# EasyEDA Pro project ProPrj_大功率电调_2026-08-17.epro, schematic 主控板V1.2

## Sheets
1 主控LKS: Assembly Variant: Basic; Board Name: Board1; Create Date: 2026-08-04; Page Name: P1; Project Name: 大功率电调; Schematic Name: Schematic1; Update Date: 2026-08-04; Company: 嘉立创EDA; Page Size: A4; Version: V1.0
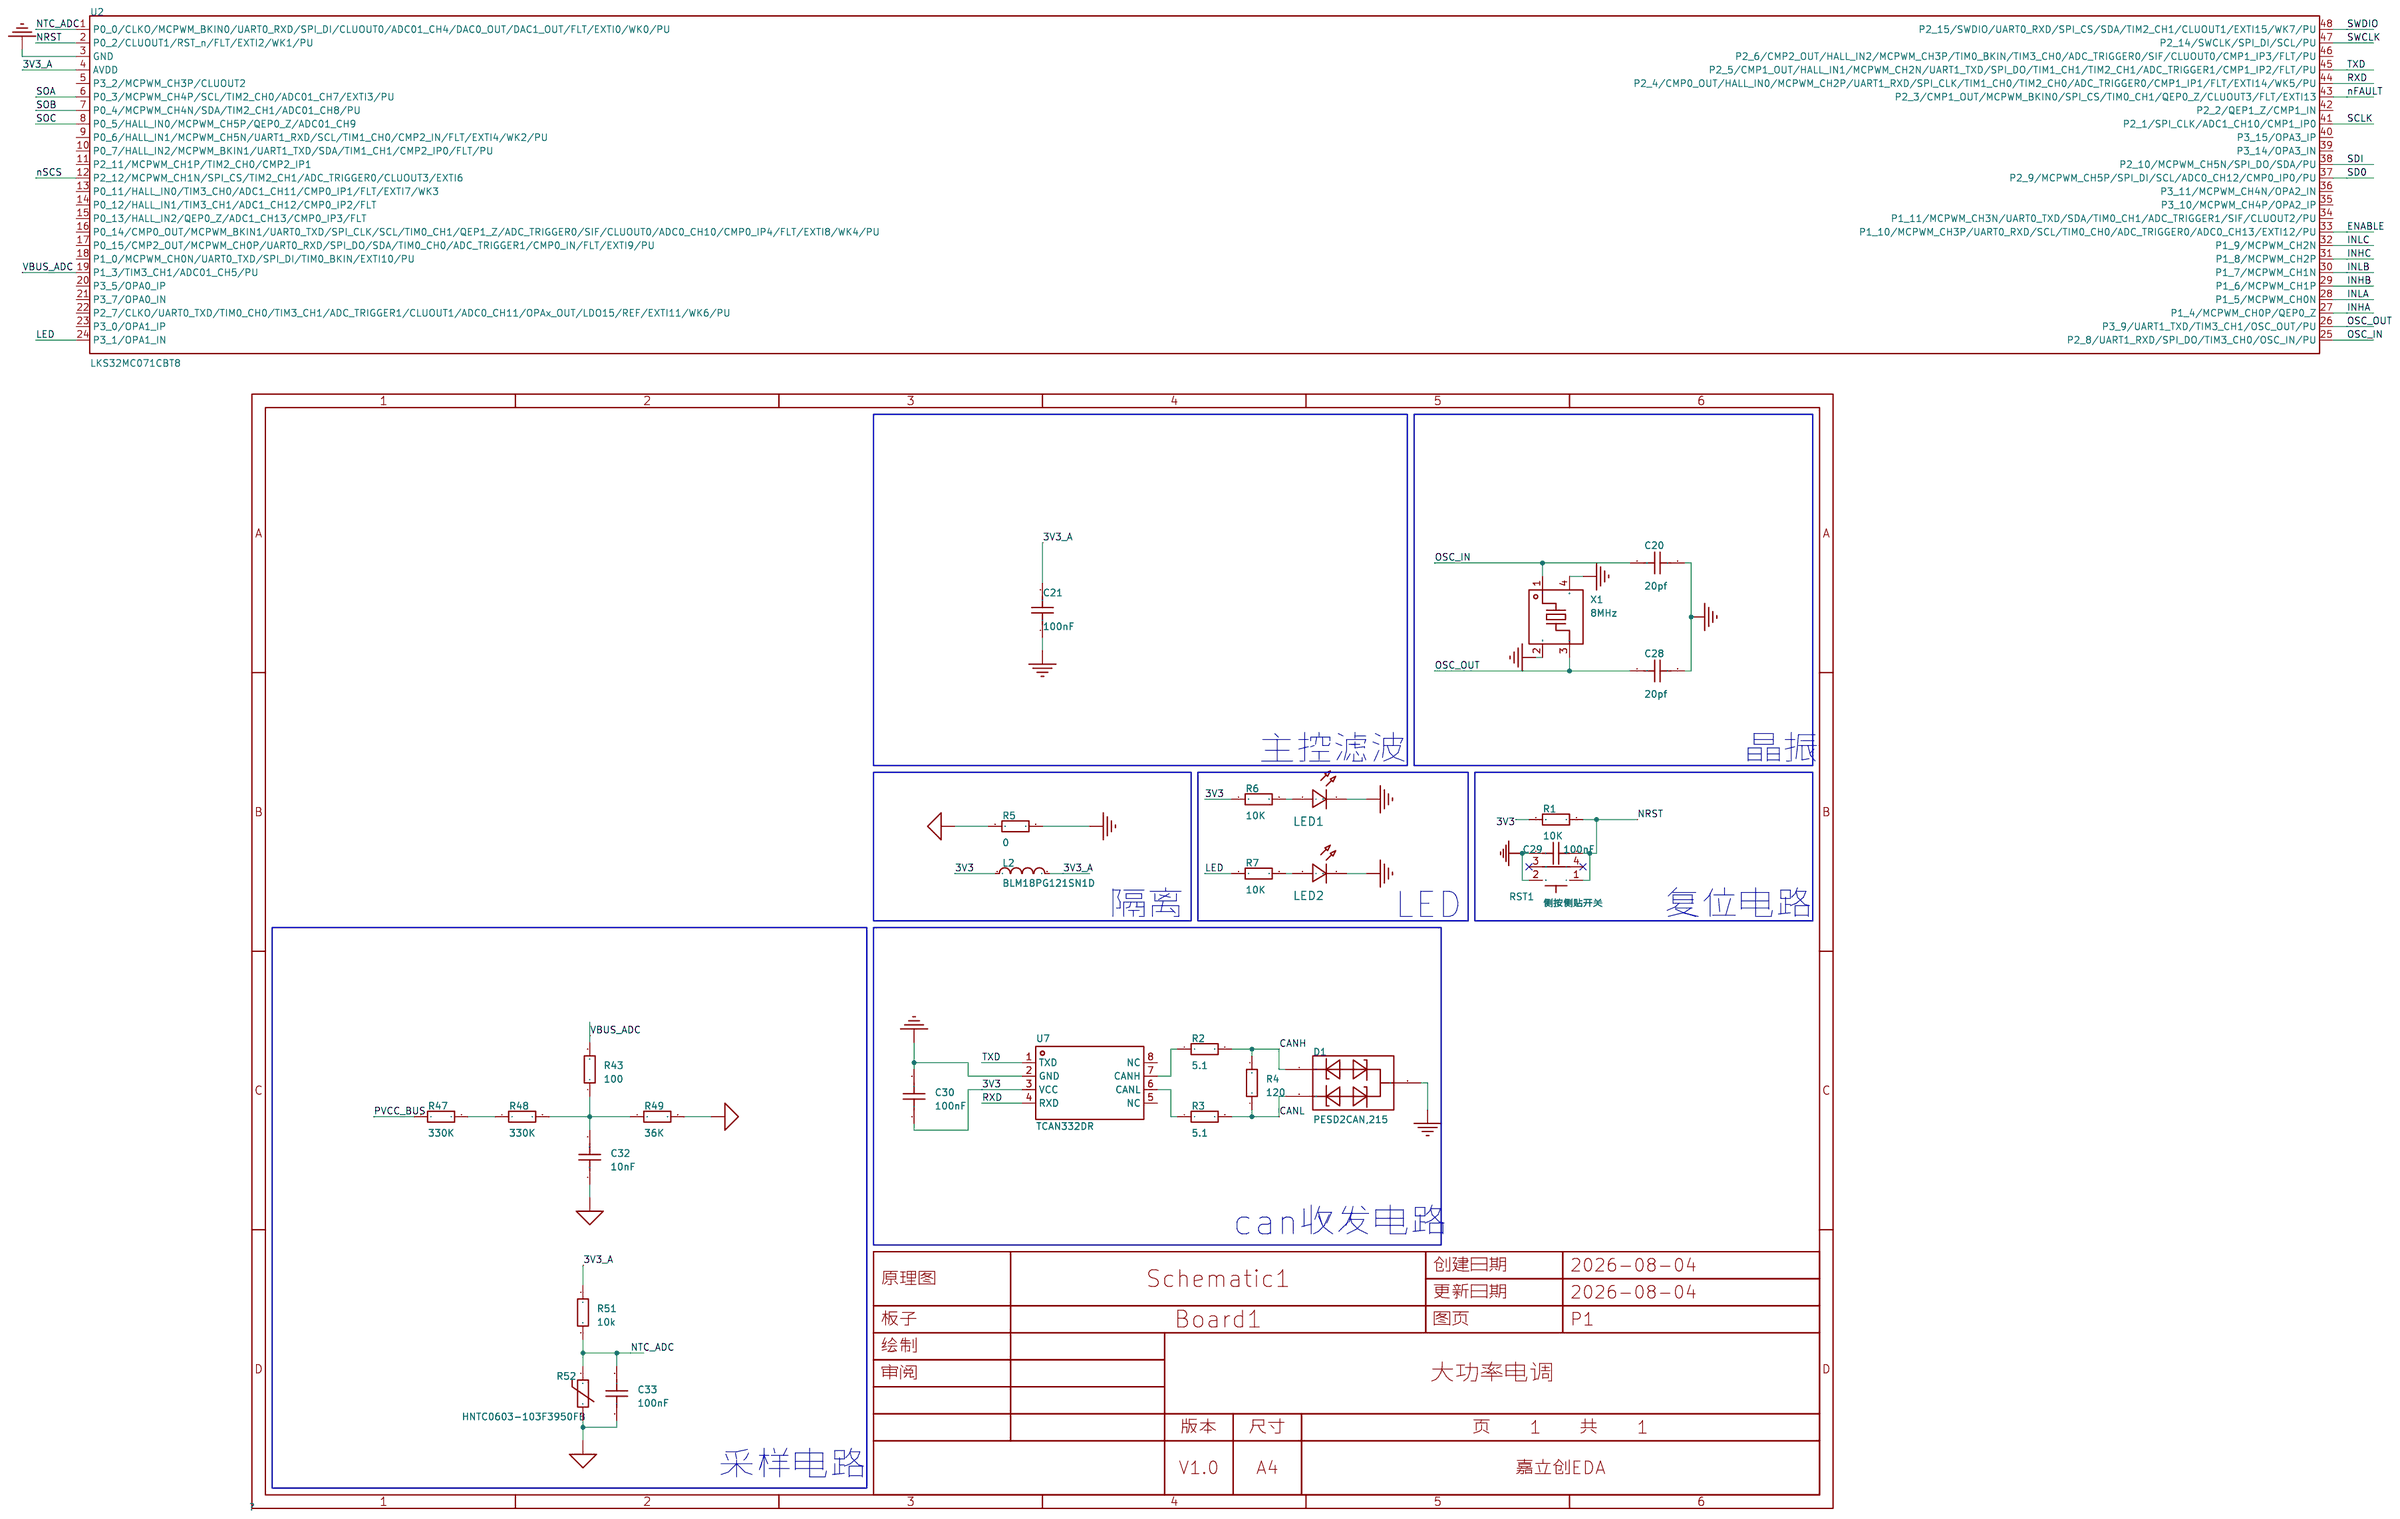
[diagram p14: 主控LKS]
2 驱动: Board Name: 主控板; Page Name: P2
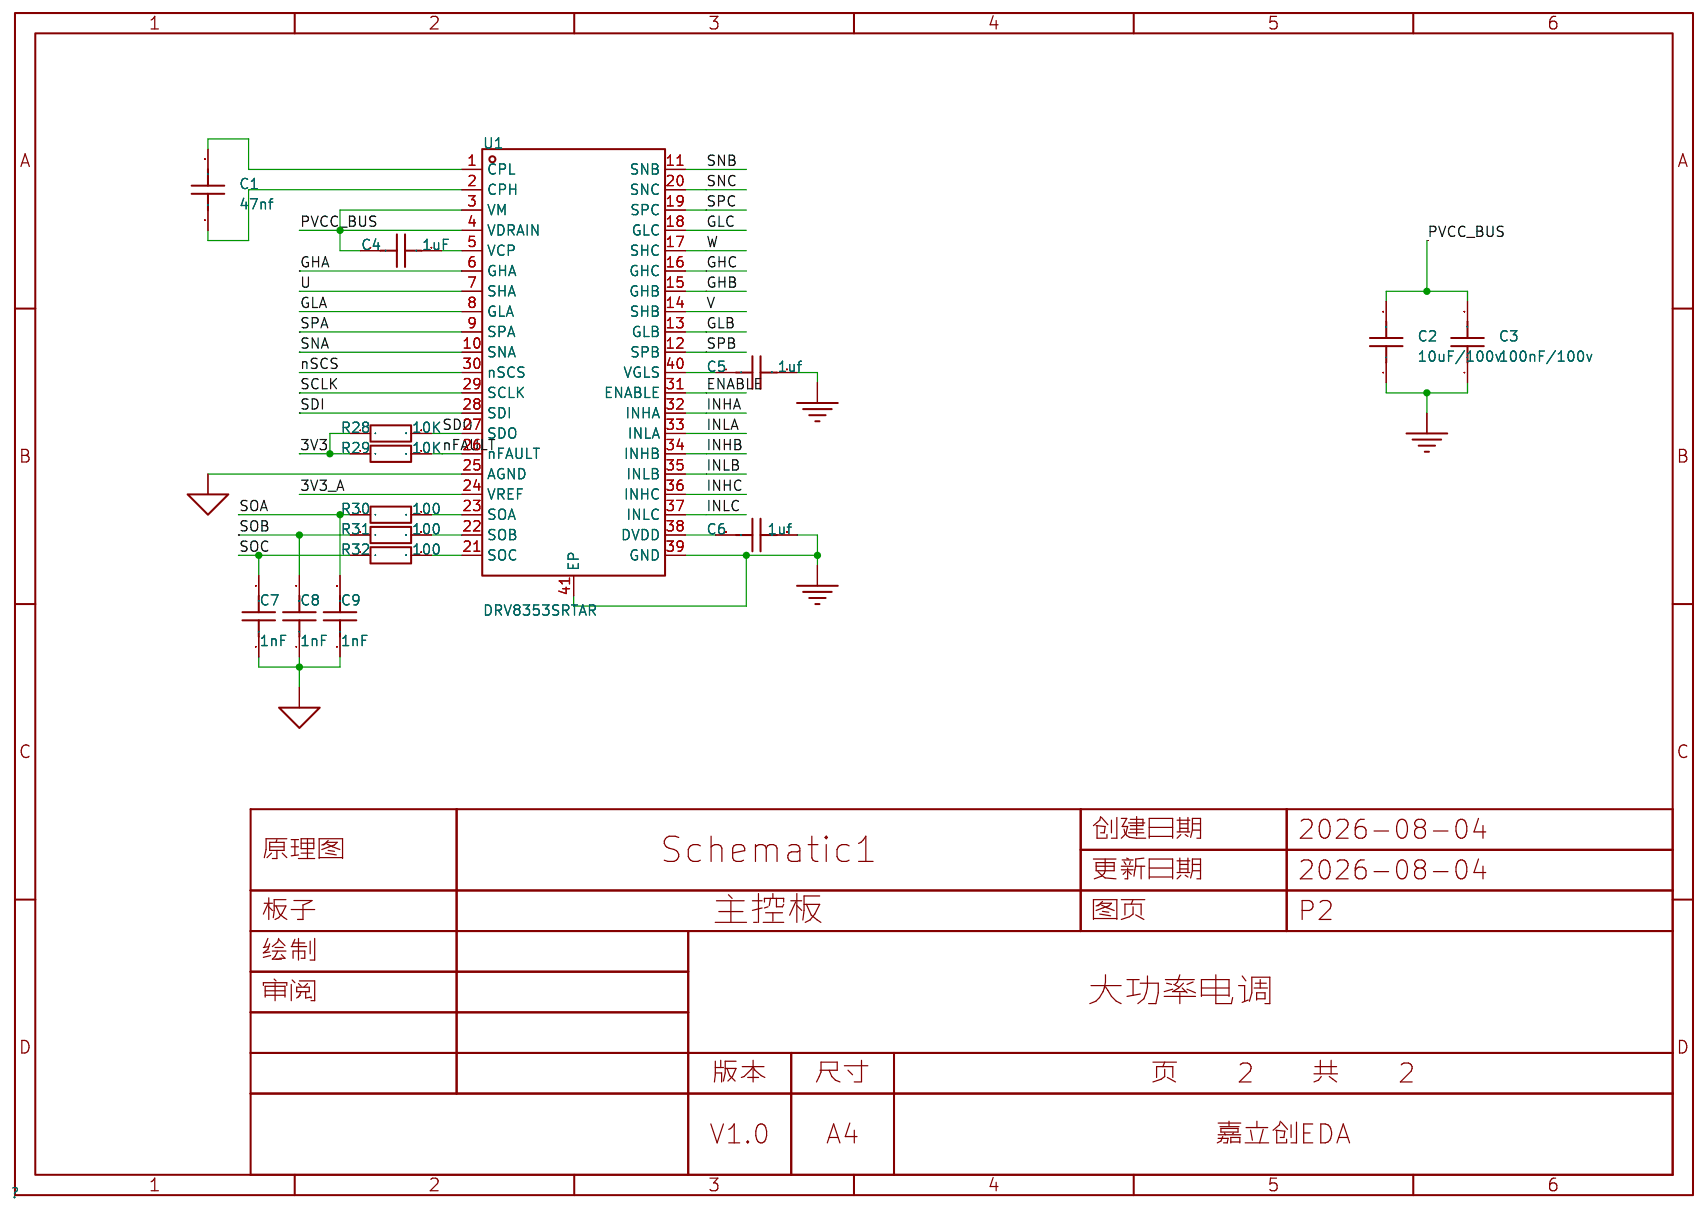
[diagram p15: 驱动]
3 电源: Board Name: 主控板
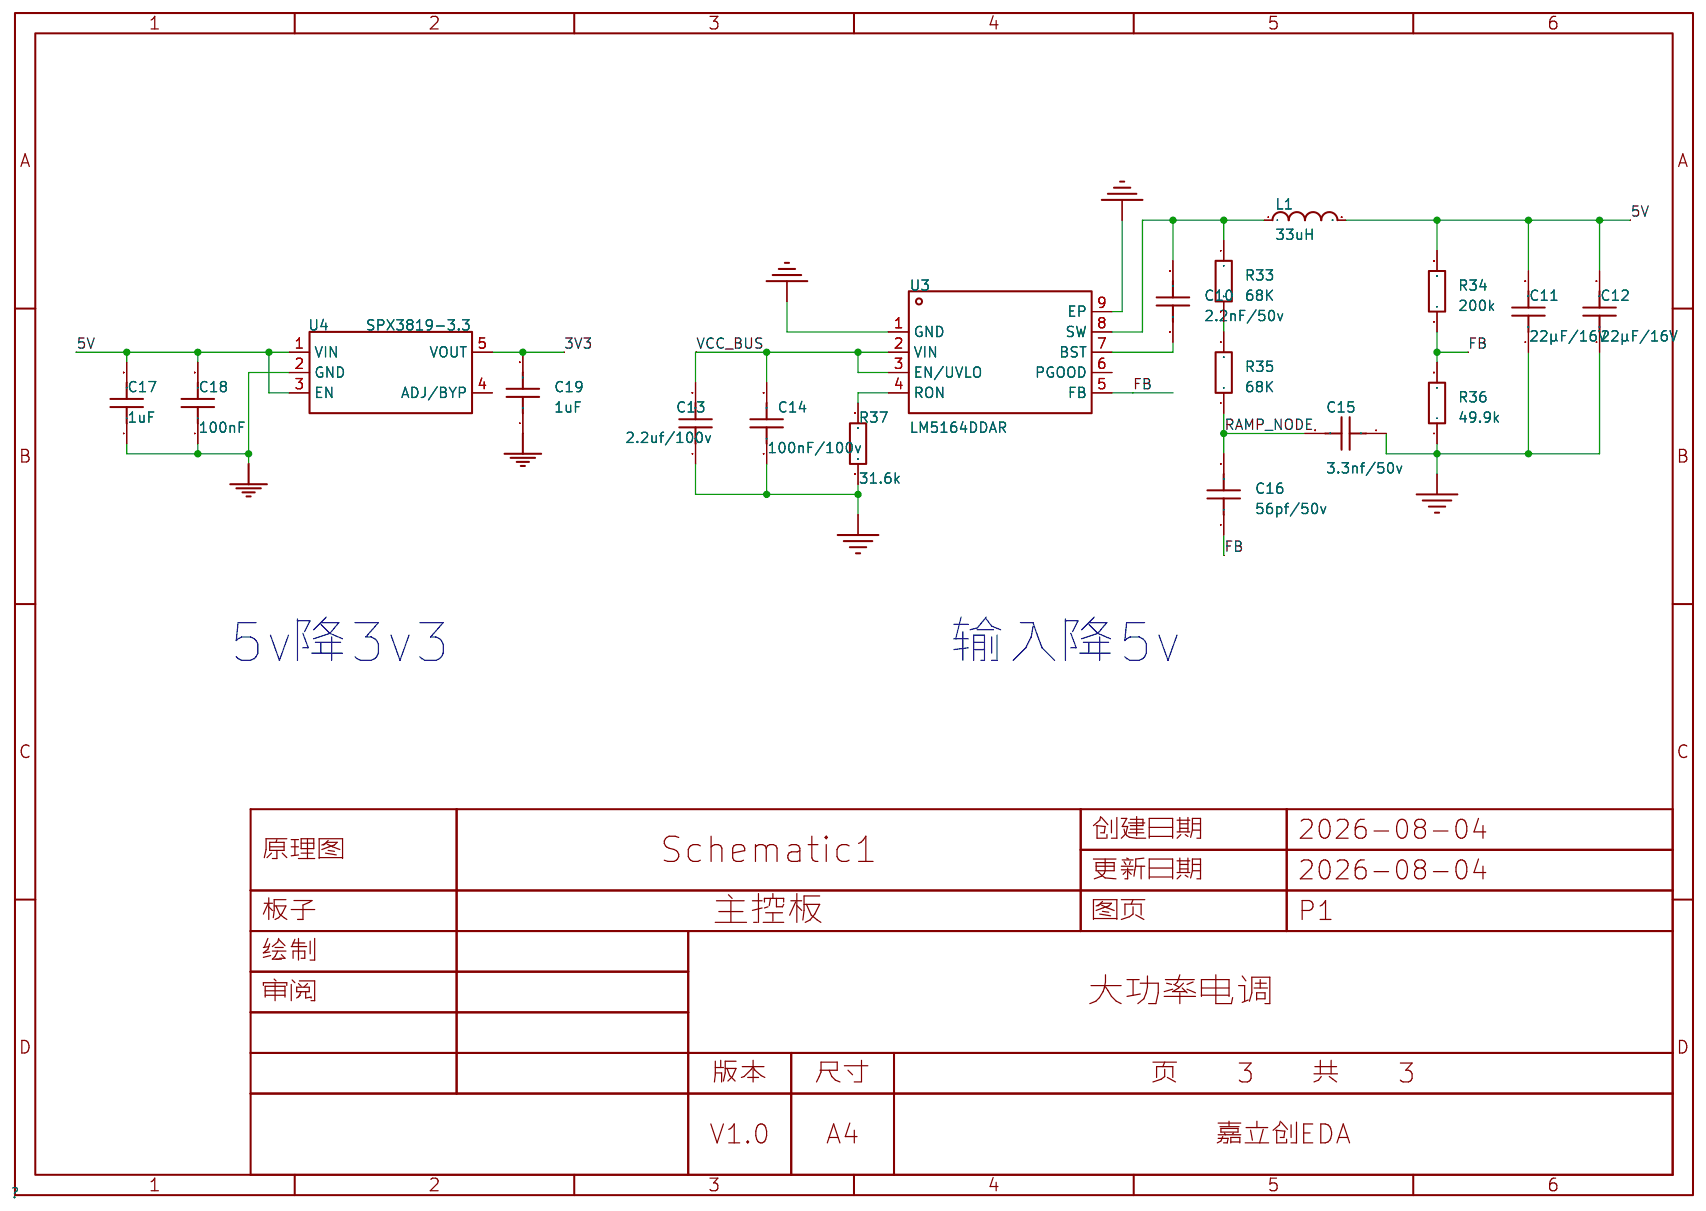
[diagram p16: 电源]

## Parts
sheet 主控LKS
C20  20pf  [C0402]
C21  100nF  [C0402]
C28  20pf  [C0402]
C29  100nF  [C0402]
C30  100nF  [C0402]
C32  10nF  [C0603]
C33  100nF  [C0603]
D1  PESD2CAN,215  [SOT-23-3_L2.9-W1.3-P1.90-LS2.4-BR]
L2  BLM18PG121SN1D  [L0603]
LED1  -  [LED_0603]
LED2  -  [LED_0603]
R1  10K  [R0402]
R2  5.1  [R0402]
R3  5.1  [R0402]
R4  120  [R0402]
R5  0  [R0805]
R6  10K  [R0402]
R7  10K  [R0402]
R43  100  [R0603]
R47  330K  [R0603]
R48  330K  [R0603]
R49  36K  [R0603]
R51  10k  [R0603]
R52  HNTC0603-103F3950FB  [R0603]
RST1  侧按侧贴开关  [KEY-SMD_1TS003B]
U2  LKS32MC071CBT8  [TQFP-48_L7.0-W7.0-P0.50-LS9.0-BL]
U7  TCAN332DR  [SOIC-8_L4.9-W3.9-P1.27-LS6.0-BL]
X1  8MHz  [CRYSTAL-SMD_4P-L3.2-W2.5-BL]
sheet 电源
C10  2.2nF/50v  [C0603]
C11  22µF/16V  [C0805]
C12  22µF/16V  [C0805]
C13  2.2uf/100v  [C1206]
C14  100nF/100v  [C1206]
C15  3.3nf/50v  [C0603]
C16  56pf/50v  [C0603]
C17  1uF  [C0402]
C18  100nF  [C0402]
C19  1uF  [C0402]
L1  33uH  [IND-SMD_L5.4-W5.2]
R33  68K  [R0603]
R34  200k  [R0603]
R35  68K  [R0603]
R36  49.9k  [R0603]
R37  31.6k  [R0603]
U3  LM5164DDAR  [SO-8_L4.9-W3.9-P1.27-LS6.0-BL-EP]
U4  SPX3819-3.3  [SOT-23-5_L2.9-W1.6-P0.95-LS2.8-BL]
sheet 驱动
C1  47nf  [C0603]
C2  10uF/100v  [C1206]
C3  100nF/100v  [C1206]
C4  1uF  [C1206]
C5  1uf  [C0603]
C6  1uf  [C0603]
C7  1nF  [C0402]
C8  1nF  [C0402]
C9  1nF  [C0402]
R28  10K  [R0402]
R29  10K  [R0402]
R30  100  [R0402]
R31  100  [R0402]
R32  100  [R0402]
U1  DRV8353SRTAR  [WQFN-40_L6.0-W6.0-P0.50-TL-EP4.5]

## Library data of the parts
C7-C9 C17-C21 C28-C30 = CAP_0402: Supplier Footprint: 0402
C1 C5 C6 C10 C15 C16 C32 C33 = CAP_0603: Supplier Footprint: 0603
D1 = PESD2CAN,215: 极性:双向;反向截止电压(Vrwm):24V;钳位电压:41V;峰值脉冲电流(Ipp):5A@8/20us;峰值脉冲功率(Ppp):230W@8/20us;击穿电压:28V;; LCSC Part Name: 双向ESD 24V截止 峰值脉冲电流：5A@8/20us; Supplier Part: C75176; Manufacturer: Nexperia(安世); Supplier Footprint: SOT-23; JLCPCB Part Class: Extended Part; Datasheet: https://item.szlcsc.com/datasheet/PESD2CAN%252C215/76300.html; Supplier: LCSC; Polarity: 双向; Reverse Stand-Off Voltage (Vrwm): 24V; Clamping Voltage: 41V; Peak Pulse Current (Ipp): 5A@8/20us; Peak Pulse Power Dissipation (Ppp): 230W@8/20us; Voltage - Breakdown: 28V; Reverse Leakage Current (Ir): 1nA; Number of Channels: 双路; Operating Temperature: -55℃~+150℃@(Ta); level of protection: IEC 61000-4-5；IEC 61000-4-2; Type: ESD; Junction Capacitance: 25pF
L2 = BLM18PG121SN1D: 阻抗@频率:120Ω@100MHz;误差:±25%;直流电阻(DCR):50mΩ;; LCSC Part Name: 单路 0603磁珠 阻抗120Ω@100MHz; Supplier Part: C14709; Manufacturer: muRata(村田); Supplier Footprint: 0603; JLCPCB Part Class: Basic Part; Datasheet: https://item.szlcsc.com/datasheet/BLM18PG121SN1D/15379.html; Supplier: LCSC; Impedance @ Frequency: 120Ω@100MHz; Tolerance: ±25%; DC Resistance(DCR): 50mΩ; Current Rating: 2A; Number of Circuits: 1; Operating Temperature: -55℃~+125℃
LED1 LED2 = LED_0603-R: Supplier Footprint: 0603
R1-R4 R6 R7 R28-R32 = Res_0402: Supplier Footprint: 0402
R5 = Res_0805: Supplier Footprint: 0805
R33-R37 R43 R47-R49 R51 = Res_0603: Supplier Footprint: 0603
R52 = HNTC0603-103F3950FB: 功率:100mW;阻值:10kΩ;电阻精度:±1%;B值精度:±1%;B值(25℃/50℃):3950K;最大稳态电流(25℃):310uA;; LCSC Part Name: 贴片NTC热敏电阻; Supplier Part: C49247666; Manufacturer: R+O(宏嘉诚); Supplier Footprint: 0603; JLCPCB Part Class: Extended Part; Datasheet: https://item.szlcsc.com/datasheet/HNTC0603-103F3950FB/51678319.html; Supplier: LCSC; Power(Watts): 100mW; Resistance @ 25℃: 10kΩ; Resistance Tolerance: ±1%; B Constant Tolerance: ±1%; B Constant (25℃/50℃): 3950K; Steady State Current (Max): 310uA; Dissipation Factor: 1mW/℃; Thermal Time Constant: 5s; Operating Temperature: -40℃~+125℃; Length: 1.6mm; Width: 0.8mm; Height: 0.8mm; Pitch: 0.3mm
RST1 = 侧按侧贴开关: Supplier: LCSC; Supplier Part: C319401; Manufacturer: HYP; Manufacturer Part: 1TS003BBB-1800-3503B
U2 = LKS32MC071CBT8: CPU内核:ARM Cortex-M0;CPU最大主频:96MHz;; LCSC Part Name: 32位内核电机控制专用MCU; Supplier Part: C5439801; Manufacturer: LINKOSEMI(凌鸥创芯); Supplier Footprint: TQFP-48; JLCPCB Part Class: Extended Part; Datasheet: https://item.szlcsc.com/datasheet/LKS32MC071CBT8/6319416.html; Supplier: LCSC; CPU Core: ARM Cortex-M0; CPU Maximum Speed: 96MHz; Program Storage Size: 128KB; ADC (Bit): 12bit; DAC (Bit): 12bit; Voltage - Supply: 2.5V~5.5V
U7 = TCAN332DR: 类型:CAN收发器;数据速率:1Mbps;; LCSC Part Name: TCAN33X具备CANFD（灵活数据速率）的3.3VCAN收发器; Supplier Part: C73651; Manufacturer: TI(德州仪器); Supplier Footprint: SOIC-8; JLCPCB Part Class: Extended Part; Datasheet: https://www.ti.com/cn/lit/ds/symlink/tcan337.pdf; Supplier: LCSC; Type: CAN收发器; Data Rate: 1Mbps; Voltage - Supply: 3V~3.6V; Current - Supply: 60mA; Operating Temperature: -40℃~+125℃; Number of Channels: 1; Quiescent Supply Current: 15uA; Features: 热关断保护；欠压保护；ESD保护；TXD占优超时
X1 = X32258MSB4SI: 晶振类型:贴片晶振;频率:8MHz;常温频差:±10ppm;负载电容:20pF;频率稳定度:±20ppm;; LCSC Part Name: YSX321SL 8MHZ 4P 3225 20PF ±10PPM -40~85℃ (±20PPM); Supplier Part: C2682774; Manufacturer: YXC(扬兴晶振); Supplier Footprint: SMD3225-4P; JLCPCB Part Class: Extended Part; Datasheet: https://item.szlcsc.com/datasheet/X32258MSB4SI/2777871.html; Supplier: LCSC; Type: 贴片晶振; Normal temperature Frequency Tolerance: ±10ppm; Load Capacitance: 20pF; Frequency Stability: ±20ppm; Operating Temperature: -40℃~+85℃
C11 C12 = CAP_0805: Supplier Footprint: 0805
C2-C4 C13 C14 = CAP_1206: Supplier Footprint: 1206
L1 = ZEMS0530-330M: 电感值:33uH;精度:±20%;额定电流:1.2A;饱和电流(Isat):2A;类型:一体成型电感;; LCSC Part Name: 33uH ±20% 2A; Supplier Part: C41413117; Manufacturer: ZE(增益); Supplier Footprint: SMD,5.4x5.2mm; JLCPCB Part Class: Extended Part; Datasheet: https://item.szlcsc.com/datasheet/ZEMS0530-330M/43227580.html; Supplier: LCSC; Tolerance: ±20%; Current Rating: 1.2A; Current - Saturation(Isat): 2A; DC Resistance(DCR): 395mΩ; Type: 一体成型电感
U3 = LM5164DDAR: 功能类型:降压型;工作电压:6V~100V;输出电压:-;输出电流:1A;输出类型:可调;; LCSC Part Name: 降压型 1A 6V~100V; Supplier Part: C477928; Manufacturer: TI(德州仪器); Supplier Footprint: SO-8-EP; JLCPCB Part Class: Extended Part; Datasheet: https://www.ti.com/cn/lit/ds/symlink/lm5164.pdf; Supplier: LCSC; Function: 降压型; Voltage - Supply: 6V~100V; Output Current: 1A; Frequency - Switching: 1MHz; Operating Temperature: -40℃~+150℃@(TJ); Synchronous Rectifier: 是; Number of Outputs: 1; Topology: 降压式; Quiescent Current: 10.5uA; Switch tube (built-in/external): 内置; Output Type: 可调; Features: 轻载高效模式；内置LDO稳压器；逐波限流；过流保护；工作状态指示
U4 = SPX3819-3.3: Supplier: LCSC; Supplier Part: C9900018941; Manufacturer: null; Manufacturer Part: SPX3819M5-3.3; JLCPCB Part Class: Extended Part
U1 = DRV8353SRTAR: 驱动配置:三相;负载类型:MOSFET;驱动通道数:6;灌电流(IOL):2A;拉电流(IOH):1A;工作电压:9V~75V;上升时间(tr):-;下降时间(tf):-;; LCSC Part Name: 100V三相智能栅极驱动器; Supplier Part: C701785; Manufacturer: TI(德州仪器); Supplier Footprint: WQFN-40-EP(6x6); JLCPCB Part Class: Extended Part; Datasheet: https://www.ti.com/cn/lit/ds/symlink/drv8353.pdf; Supplier: LCSC; Driven Configuration: 三相; Load Type: MOSFET; Number of Drivers: 6; Current - Output Low(IOL): 2A; Current - Output High(IOH): 1A; Voltage - Supply: 9V~75V; Features: 使能关断；交错导通保护；死区时间控制；充电泵升压; Operating Temperature: -40℃~+125℃; Input Logic Level - High: 1.5V; Input Logic Level - Low: 800mV; Quiescent Current(Iq): 20uA

## Nets
3V3: C19.2 C30.1 L2.1 R1.1 R6.1 R28.1 R29.1 U4.5(VOUT) U7.3(VCC)
3V3_A: C21.2 L2.2 R51.1 U1.24(VREF) U2.4(AVDD)
5V: C11.2 C12.2 C17.2 C18.2 L1.2 R34.2 U4.1(VIN) U4.3(EN)
AGND: C7.1 C8.1 C9.1 C32.1 C33.1 R5.1 R49.2 R52.2 U1.25(AGND)
GND: C2.1 C3.1 C5.2 C6.2 C11.1 C12.1 C13.1 C14.1 C15.1 C17.1 C18.1 C19.1 C20.2 C21.1 C28.2 C29.1 C30.2 D1.3 LED1.1(C) LED2.1(C) R5.2 R36.1 R37.1 RST1.2 U1.39(GND) U1.41(EP) U2.3(GND) U3.1(GND) U3.9(EP) U4.2(GND) U7.2(GND) X1.2(GND) X1.4(GND)
PVCC_BUS: C2.2 C3.2 C4.1 R47.1 U1.3(VM) U1.4(VDRAIN)
VBUS_ADC: R43.2 U2.19(P1_3/TIM3_CH1/ADC01_CH5/PU)
VCC_BUS: C13.2 C14.2 U3.2(VIN) U3.3(EN/UVLO)
CANH: D1.1 R2.2 R4.2
CANL: D1.2 R3.2 R4.1
ENABLE: U1.31(ENABLE) U2.33(P1_10/MCPWM_CH3P/UART0_RXD/SCL/TIM0_CH0/ADC_TRIGGER0/ADC0_CH13/EXTI12/PU)
FB: C16.1 R34.1 R36.2 U3.5(FB)
GHA: U1.6(GHA)
GHB: U1.15(GHB)
GHC: U1.16(GHC)
GLA: U1.8(GLA)
GLB: U1.13(GLB)
GLC: U1.18(GLC)
INHA: U1.32(INHA) U2.27(P1_4/MCPWM_CH0P/QEP0_Z)
INHB: U1.34(INHB) U2.29(P1_6/MCPWM_CH1P)
INHC: U1.36(INHC) U2.31(P1_8/MCPWM_CH2P)
INLA: U1.33(INLA) U2.28(P1_5/MCPWM_CH0N)
INLB: U1.35(INLB) U2.30(P1_7/MCPWM_CH1N)
INLC: U1.37(INLC) U2.32(P1_9/MCPWM_CH2N)
LED: R7.1 U2.24(P3_1/OPA1_IN)
nFAULT: R29.2 U1.26(nFAULT) U2.43(P2_3/CMP1_OUT/MCPWM_BKIN0/SPI_CS/TIM0_CH1/QEP0_Z/CLUOUT3/FLT/EXTI13)
NRST: C29.2 R1.2 RST1.1 U2.2(P0_2/CLUOUT1/RST_n/FLT/EXTI2/WK1/PU)
nSCS: U1.30(nSCS) U2.12(P2_12/MCPWM_CH1N/SPI_CS/TIM2_CH1/ADC_TRIGGER0/CLUOUT3/EXTI6)
NTC_ADC: C33.2 R51.2 R52.1 U2.1(P0_0/CLKO/MCPWM_BKIN0/UART0_RXD/SPI_DI/CLUOUT0/ADC01_CH4/DAC0_OUT/DAC1_OUT/FLT/EXTI0/WK0/PU)
OSC_IN: C20.1 U2.25(P2_8/UART1_RXD/SPI_DO/TIM3_CH0/OSC_IN/PU) X1.1
OSC_OUT: C28.1 U2.26(P3_9/UART1_TXD/TIM3_CH1/OSC_OUT/PU) X1.3
RAMP_NODE: C15.2 C16.2 R35.1
RXD: U2.44(P2_4/CMP0_OUT/HALL_IN0/MCPWM_CH2P/UART1_RXD/SPI_CLK/TIM1_CH0/TIM2_CH0/ADC_TRIGGER0/CMP1_IP1/FLT/EXTI14/WK5/PU) U7.4(RXD)
SCLK: U1.29(SCLK) U2.41(P2_1/SPI_CLK/ADC1_CH10/CMP1_IP0)
SD0: U2.37(P2_9/MCPWM_CH5P/SPI_DI/SCL/ADC0_CH12/CMP0_IP0/PU)
SDI: U1.28(SDI) U2.38(P2_10/MCPWM_CH5N/SPI_DO/SDA/PU)
SDO: R28.2 U1.27(SDO)
SNA: U1.10(SNA)
SNB: U1.11(SNB)
SNC: U1.20(SNC)
SOA: C9.2 R30.1 U2.6(P0_3/MCPWM_CH4P/SCL/TIM2_CH0/ADC01_CH7/EXTI3/PU)
SOB: C8.2 R31.1 U2.7(P0_4/MCPWM_CH4N/SDA/TIM2_CH1/ADC01_CH8/PU)
SOC: C7.2 R32.1 U2.8(P0_5/HALL_IN0/MCPWM_CH5P/QEP0_Z/ADC01_CH9)
SPA: U1.9(SPA)
SPB: U1.12(SPB)
SPC: U1.19(SPC)
SWCLK: U2.47(P2_14/SWCLK/SPI_DI/SCL/PU)
SWDIO: U2.48(P2_15/SWDIO/UART0_RXD/SPI_CS/SDA/TIM2_CH1/CLUOUT1/EXTI15/WK7/PU)
TXD: U2.45(P2_5/CMP1_OUT/HALL_IN1/MCPWM_CH2N/UART1_TXD/SPI_DO/TIM1_CH1/TIM2_CH1/ADC_TRIGGER1/CMP1_IP2/FLT/PU) U7.1(TXD)
U: U1.7(SHA)
V: U1.14(SHB)
W: U1.17(SHC)
$1N4: LED2.2(A) R7.2
$1N5: LED1.2(A) R6.2
$1N19: R2.1 U7.7(CANH)
$1N20: R3.1 U7.6(CANL)
$1N26: C32.2 R43.1 R48.2 R49.1
$1N27: R47.2 R48.1
$2N6: C6.1 U1.38(DVDD)
$2N8: C5.1 U1.40(VGLS)
$2N26: R32.2 U1.21(SOC)
$2N27: R31.2 U1.22(SOB)
$2N28: R30.2 U1.23(SOA)
$2N30: C4.2 U1.5(VCP)
$2N42: C1.1 U1.2(CPH)
$2N43: C1.2 U1.1(CPL)
$3N3: R33.2 R35.2
$3N8: C10.2 L1.1 R33.1 U3.8(SW)
$3N9: C10.1 U3.7(BST)
$3N14: R37.2 U3.4(RON)

Not connected (* = marked no-connect by the designer): RST1 3* 4*; U2 5(P3_2/MCPWM_CH3P/CLUOUT2) 9(P0_6/HALL_IN1/MCPWM_CH5N/UART1_RXD/SCL/TIM1_CH0/CMP2_IN/FLT/EXTI4/WK2/PU) 10(P0_7/HALL_IN2/MCPWM_BKIN1/UART1_TXD/SDA/TIM1_CH1/CMP2_IP0/FLT/PU) 11(P2_11/MCPWM_CH1P/TIM2_CH0/CMP2_IP1) 13(P0_11/HALL_IN0/TIM3_CH0/ADC1_CH11/CMP0_IP1/FLT/EXTI7/WK3) 14(P0_12/HALL_IN1/TIM3_CH1/ADC1_CH12/CMP0_IP2/FLT) 15(P0_13/HALL_IN2/QEP0_Z/ADC1_CH13/CMP0_IP3/FLT) 16(P0_14/CMP0_OUT/MCPWM_BKIN1/UART0_TXD/SPI_CLK/SCL/TIM0_CH1/QEP1_Z/ADC_TRIGGER0/SIF/CLUOUT0/ADC0_CH10/CMP0_IP4/FLT/EXTI8/WK4/PU) 17(P0_15/CMP2_OUT/MCPWM_CH0P/UART0_RXD/SPI_DO/SDA/TIM0_CH0/ADC_TRIGGER1/CMP0_IN/FLT/EXTI9/PU) 18(P1_0/MCPWM_CH0N/UART0_TXD/SPI_DI/TIM0_BKIN/EXTI10/PU) 20(P3_5/OPA0_IP) 21(P3_7/OPA0_IN) 22(P2_7/CLKO/UART0_TXD/TIM0_CH0/TIM3_CH1/ADC_TRIGGER1/CLUOUT1/ADC0_CH11/OPAx_OUT/LDO15/REF/EXTI11/WK6/PU) 23(P3_0/OPA1_IP) 34(P1_11/MCPWM_CH3N/UART0_TXD/SDA/TIM0_CH1/ADC_TRIGGER1/SIF/CLUOUT2/PU) 35(P3_10/MCPWM_CH4P/OPA2_IP) 36(P3_11/MCPWM_CH4N/OPA2_IN) 39(P3_14/OPA3_IN) 40(P3_15/OPA3_IP) 42(P2_2/QEP1_Z/CMP1_IN) 46(P2_6/CMP2_OUT/HALL_IN2/MCPWM_CH3P/TIM0_BKIN/TIM3_CH0/ADC_TRIGGER0/SIF/CLUOUT0/CMP1_IP3/FLT/PU); U3 6(PGOOD); U4 4(ADJ/BYP); U7 5(NC) 8(NC)

## Notes on the sheets
sheet 1
- 主控滤波
- 晶振
- 隔离
- LED
- 复位电路
- can收发电路
- 采样电路
sheet 3
- 5v降3v3
- 输入降5v
